# Altium schematic sheet Step Moter Control.SchDoc
size A4
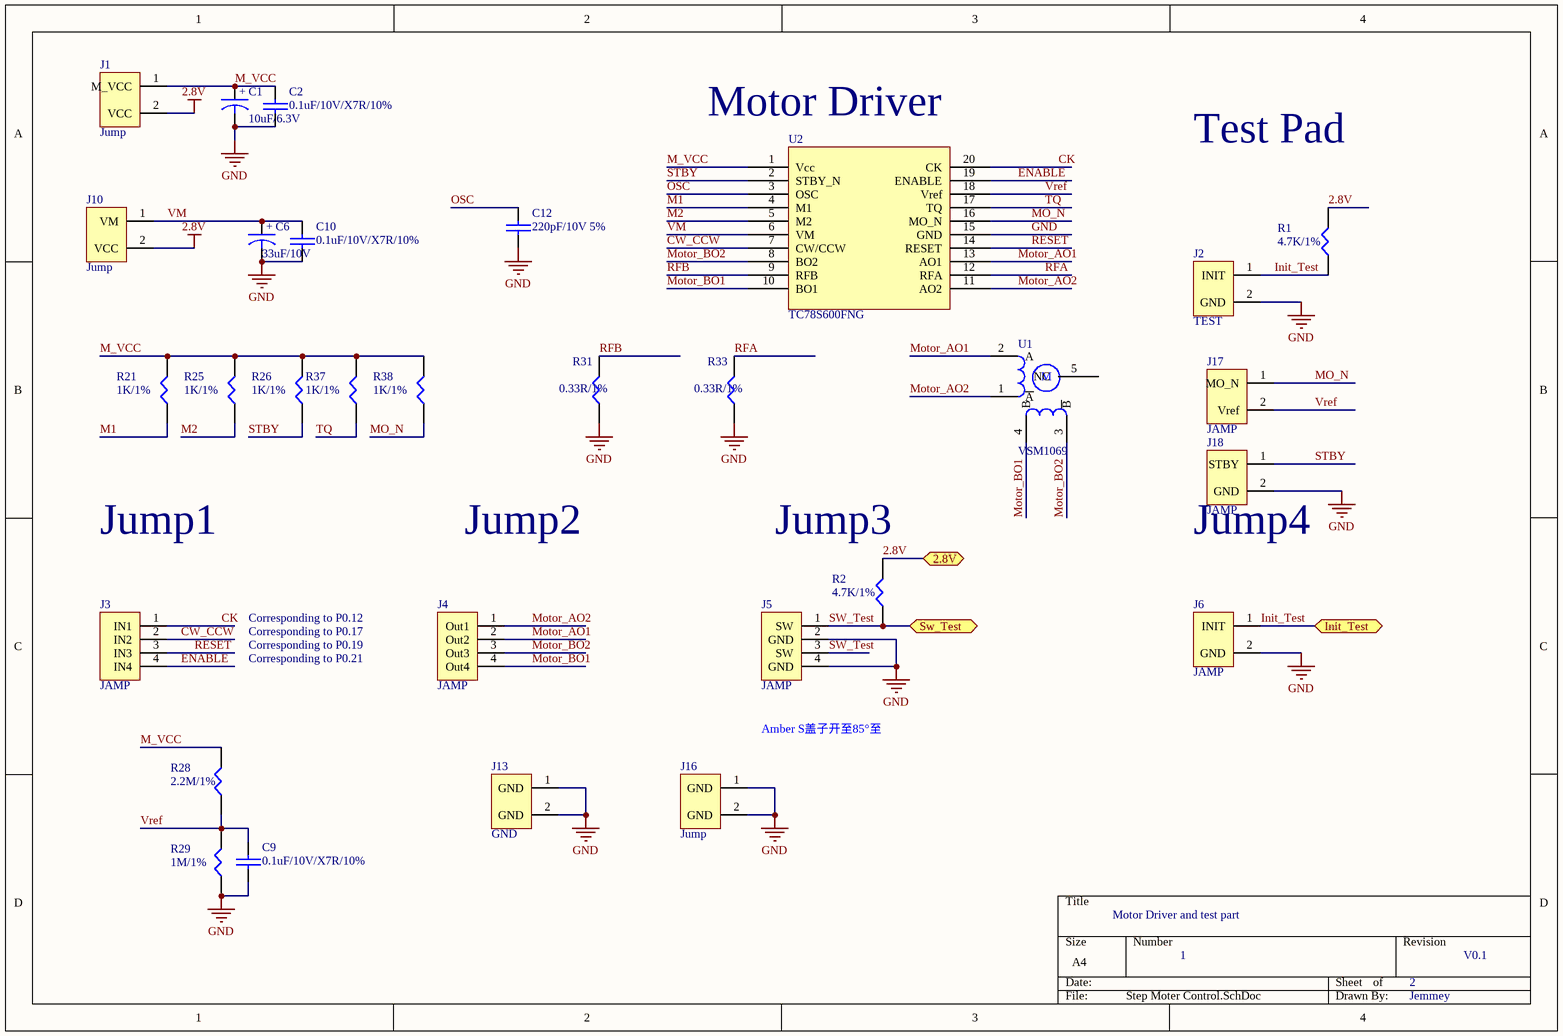
[diagram p0: Step Moter Control.SchDoc]

## Parts
C1  10uF/6.3V  [3216]
C2  0.1uF/10V/X7R/10%  [0402C]
C6  33uF/10V  [3216]
C9  0.1uF/10V/X7R/10%  [0402C]
C10  0.1uF/10V/X7R/10%  [0402C]
C12  220pF/10V 5%  [0402C]
J1  Jump  [Debug- 1.27*2]
J2  TEST  [Debug- 1.27*2]
J3  JAMP  [Debug- 1.27*4]
J4  JAMP  [Debug- 1.27*4]
J5  JAMP  [Debug- 1.27*4]
J6  JAMP  [Debug- 1.27*2]
J10  Jump  [Debug- 1.27*2]
J13  GND  [Debug- 1.27*2]
J16  Jump  [Debug- 1.27*2]
J17  JAMP  [Debug- 1.27*2]
J18  JAMP  [Debug- 1.27*2]
R1  4.7K/1%  [0402R]
R2  4.7K/1%  [0402R]
R21  1K/1%  [0402R]
R25  1K/1%  [0402R]
R26  1K/1%  [0402R]
R28  2.2M/1%  [0402R]
R29  1M/1%  [0402R]
R31  0.33R/1%  [0603R]
R33  0.33R/1%  [0603R]
R37  1K/1%  [0402R]
R38  1K/1%  [0402R]
U1  VSM1069  [6200]
U2  TC78S600FNG  [TSSOP-20]

## Ports
2.8V, Init_Test, Sw_Test

## Nets
2.8V: J1.2(VCC) J10.2(VCC) R1.2 R2.2 ; port 2.8V
GND: C1.2 C2.2 C6.2 C9.2 C10.2 C12.2 J2.2(GND) J5.2(GND) J5.4(GND) J6.2(GND) J13.1(GND) J13.2(GND) J16.1(GND) J16.2(GND) J18.2(GND) R29.1 R31.1 R33.1 U2.15(GND)
CK: J3.1(IN1) U2.20(CK)
CW_CCW: J3.2(IN2) U2.7(CW/CCW)
ENABLE: J3.4(IN4) U2.19(ENABLE)
Init_Test: J2.1(INIT) J6.1(INIT) R1.1 ; port Init_Test
M1: R21.1 U2.4(M1)
M2: R25.1 U2.5(M2)
M_VCC: C1.1 C2.1 J1.1(M_VCC) R21.2 R25.2 R26.2 R28.2 R37.2 R38.2 U2.1(Vcc)
MO_N: J17.1(MO_N) R38.1 U2.16(MO_N)
Motor_AO1: J4.2(Out2) U1.2(A) U2.13(AO1)
Motor_AO2: J4.1(Out1) U1.1(~{A}) U2.11(AO2)
Motor_BO1: J4.4(Out4) U1.4(B) U2.10(BO1)
Motor_BO2: J4.3(Out3) U1.3(~{B}) U2.8(BO2)
OSC: C12.1 U2.3(OSC)
RESET: J3.3(IN3) U2.14(RESET)
RFA: R33.2 U2.12(RFA)
RFB: R31.2 U2.9(RFB)
STBY: J18.1(STBY) R26.1 U2.2(STBY_N)
SW_Test: J5.1(SW) J5.3(SW) R2.1 ; port Sw_Test
TQ: R37.1 U2.17(TQ)
VM: C6.1 C10.1 J10.1(VM) U2.6(VM)
Vref: C9.1 J17.2(Vref) R28.1 R29.2 U2.18(Vref)

Not connected (* = marked no-connect by the designer): U1 5(NC)

## Notes on the sheet
- (near U2) Motor Driver
- Test Pad
- Jump1
- Jump2
- (near R2) Jump3
- (near J18) Jump4
- Corresponding to P0.19
- Corresponding to P0.17
- Corresponding to P0.12
- Corresponding to P0.21
- Amber S盖子开至85°至
- Motor Driver and test part
- 1
- 2
- V0.1
- Jemmey
- (in symbol Cap) +
- (in symbol VSM1069) M

## Library data of the parts
C1 C6 = Cap: 厂家：ROHM，型号：
C2 C9 C10 C12 = CAP: 厂家：Murata，型号：GRM155R71A104KA01D
J1 J3-J6 J10 J13 J16-J18 = JAMP: 厂家：暂定，型号：暂定
J2 = TEST: 厂家：暂定，型号：暂定
R1 R2 R21 R25 R26 R28 R29 R31 R33 R37 R38 = RES1: 厂家：Yageo，型号：RC0402FR-074K7L
U1 = VSM1069: 厂家：常州唯可泰，型号：VSM1069；二相步进电机